# Altium schematic sheet eCore_MCU.SchDoc
size A4
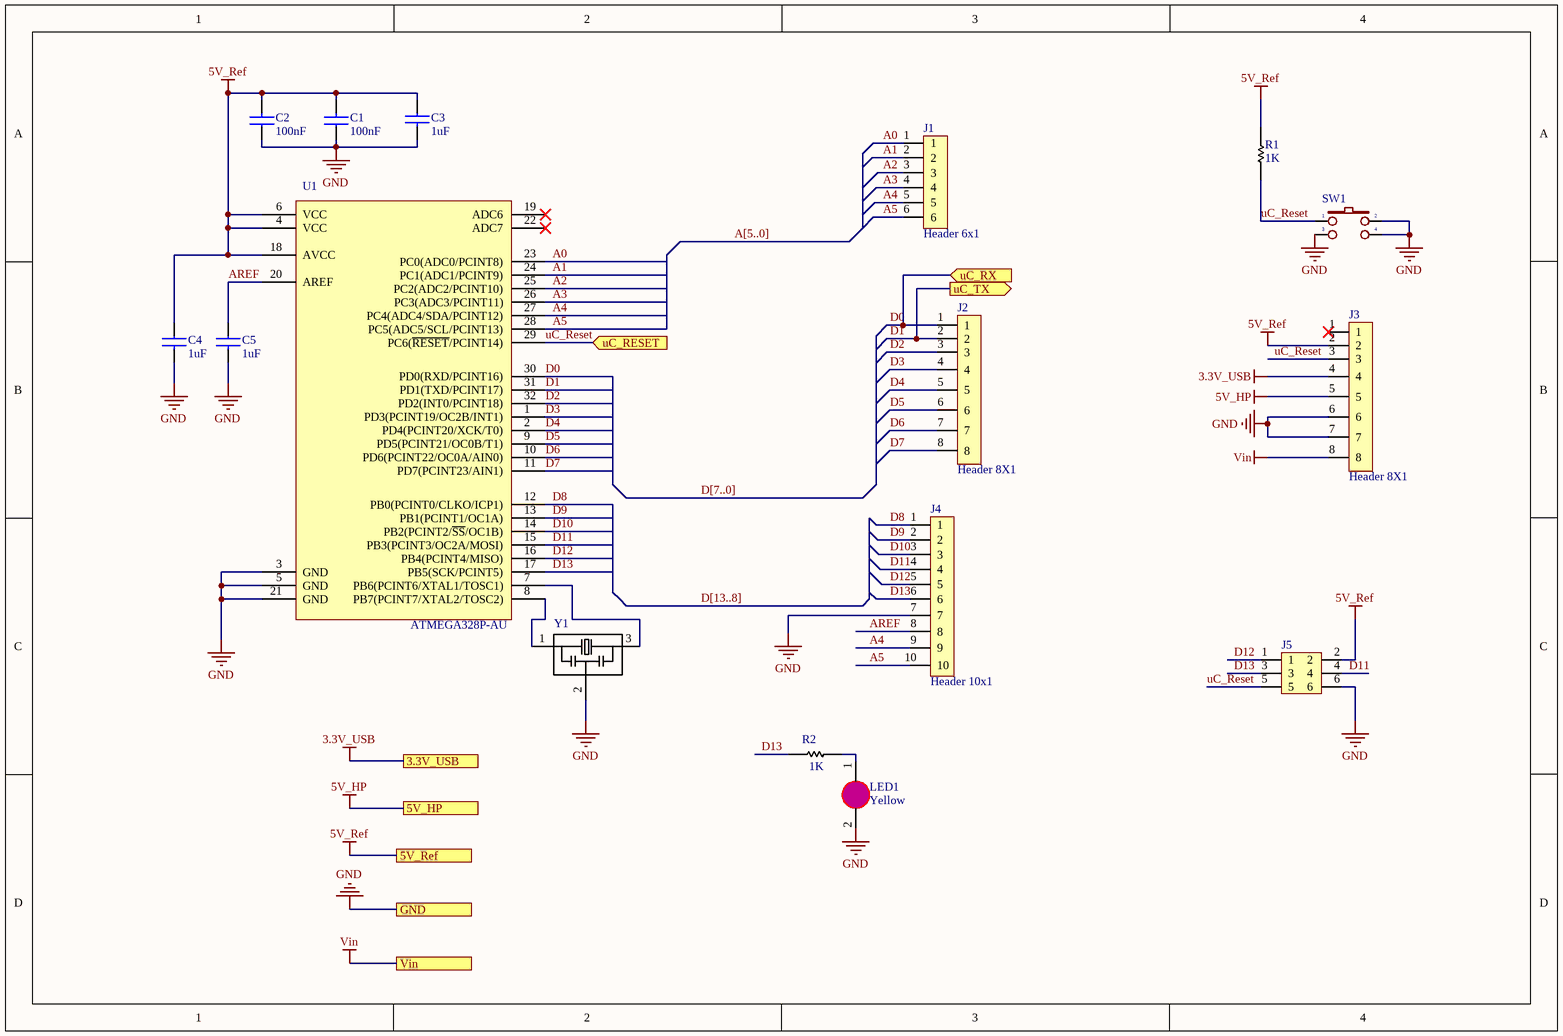
[diagram p0: eCore_MCU.SchDoc]

## Parts
C1  100nF  [CAPC1005X60N]
C2  100nF  [CAPC1005X60N]
C3  1uF  [C0603]
C4  1uF  [CAPC1005X60N]
C5  1uF  [CAPC1005X60N]
J1  Header 6x1  [1x6 Socket Heder 2.54mm]
J2  Header 8X1  [1x8 Socket Heder 2.54mm]
J3  Header 8X1  [1x8 Socket Heder 2.54mm]
J4  Header 10x1  [1x10 Socket Header 2.54mm]
J5  Header 3x2  [HEADER 3X3]  (value not drawn)
LED1  Yellow  [LEDY-0402]
R1  1K  [RES 0402 SMD]
R2  1K  [RES 0402 SMD]
SW1  SW2-SMD  [SW-SMD]  (value not drawn)
U1  ATMEGA328P-AU  [QFP80P900X900X120-32N]
Y1  CSTCE16M0V53-R0  [OSC_CSTCE16M0V53-R0]  (value not drawn)

## Ports
3.3V_USB, 5V_HP, 5V_Ref, GND, uC_RESET (in), uC_RX (in), uC_TX (out), Vin

## Nets
3.3V_USB: J3.4 ; port 3.3V_USB
5V_HP: J3.5 ; port 5V_HP
5V_Ref: C1.2 C2.2 C3.1 C4.1 J3.2 J5.2 R1.2 U1.4(VCC) U1.6(VCC) U1.18(AVCC) ; port 5V_Ref
GND: C1.1 C2.1 C3.2 C4.2 C5.2 J3.6 J3.7 J4.7 J5.6 LED1.2(K) SW1.2 SW1.S1 SW1.S2 U1.3(GND) U1.5(GND) U1.21(GND) Y1.2 ; port GND
Vin: J3.8 ; port Vin
A0: J1.1 U1.23(PC0(ADC0/PCINT8))
A1: J1.2 U1.24(PC1(ADC1/PCINT9))
A2: J1.3 U1.25(PC2(ADC2/PCINT10))
A3: J1.4 U1.26(PC3(ADC3/PCINT11))
A4: J1.5 J4.9 U1.27(PC4(ADC4/SDA/PCINT12))
A5: J1.6 J4.10 U1.28(PC5(ADC5/SCL/PCINT13))
AREF: C5.1 J4.8 U1.20(AREF)
D0: J2.1 U1.30(PD0(RXD/PCINT16)) ; port uC_RX
D1: J2.2 U1.31(PD1(TXD/PCINT17)) ; port uC_TX
D2: J2.3 U1.32(PD2(INT0/PCINT18))
D3: J2.4 U1.1(PD3(PCINT19/OC2B/INT1))
D4: J2.5 U1.2(PD4(PCINT20/XCK/T0))
D5: J2.6 U1.9(PD5(PCINT21/OC0B/T1))
D6: J2.7 U1.10(PD6(PCINT22/OC0A/AIN0))
D7: J2.8 U1.11(PD7(PCINT23/AIN1))
D8: J4.1 U1.12(PB0(PCINT0/CLKO/ICP1))
D9: J4.2 U1.13(PB1(PCINT1/OC1A))
D10: J4.3 U1.14(PB2(PCINT2/~{SS}/OC1B))
D11: J4.4 J5.4 U1.15(PB3(PCINT3/OC2A/MOSI))
D12: J4.5 J5.1 U1.16(PB4(PCINT4/MISO))
D13: J4.6 J5.3 R2.1 U1.17(PB5(SCK/PCINT5))
uC_Reset: J3.3 J5.5 R1.1 SW1.1 U1.29(PC6(~{RESET}/PCINT14)) ; port uC_RESET
NetLED1_1: LED1.1(A) R2.2
NetU1_7: U1.7(PB6(PCINT6/XTAL1/TOSC1)) Y1.3
NetU1_8: U1.8(PB7(PCINT7/XTAL2/TOSC2)) Y1.1

Not connected (* = marked no-connect by the designer): J3 1*; U1 19(ADC6)* 22(ADC7)*

## Buses and harness runs
bus A[5..0]
bus D[7..0]
bus D[13..8]

## Notes on the sheet
- (in symbol SW2-SMD) 3; 4

## Library data of the parts
C1 C2 C4 C5 = Cap 0402
C3 = Cap 0603: Right: 20; Bottom: 10
LED1 = LEDSMD: LED 3mm
R1 R2 = Res 0402: Resistor; Manufacturer: Generic Components; Class: Passive; Published: 08/06/2000; Publisher: Altium Hobart Technology Centre; SubClass: Resistor
SW1 = SW2-SMD: Switch button 2 pin; Value: SW chip 2 pin
U1 = ATMEGA328P-AU: ATmega Series 20 MHz 32 KB Flash 2 KB SRAM 8-Bit Microcontroller - TQFP-32; MF: Atmel; Price: 2.38 USD; Availability: Good; MP: ATMEGA328P-AU; Package: TQFP-32 Atmel; Value: *
Y1 = XTAL-CSTCE16M0V53-R0: Ceramic Resonator 16MHz ??0.5% (Tol) ??0.3% (Stability) 15pF 40Ohm 3-Pin CSMD T/R; MF: Murata; MP: CSTCE16M0V53-R0; Availability: Good; Package: SMD-3 Murata; Price: 0.29 USD; Value: *